# Altium schematic sheet FEM.SchDoc
size A4
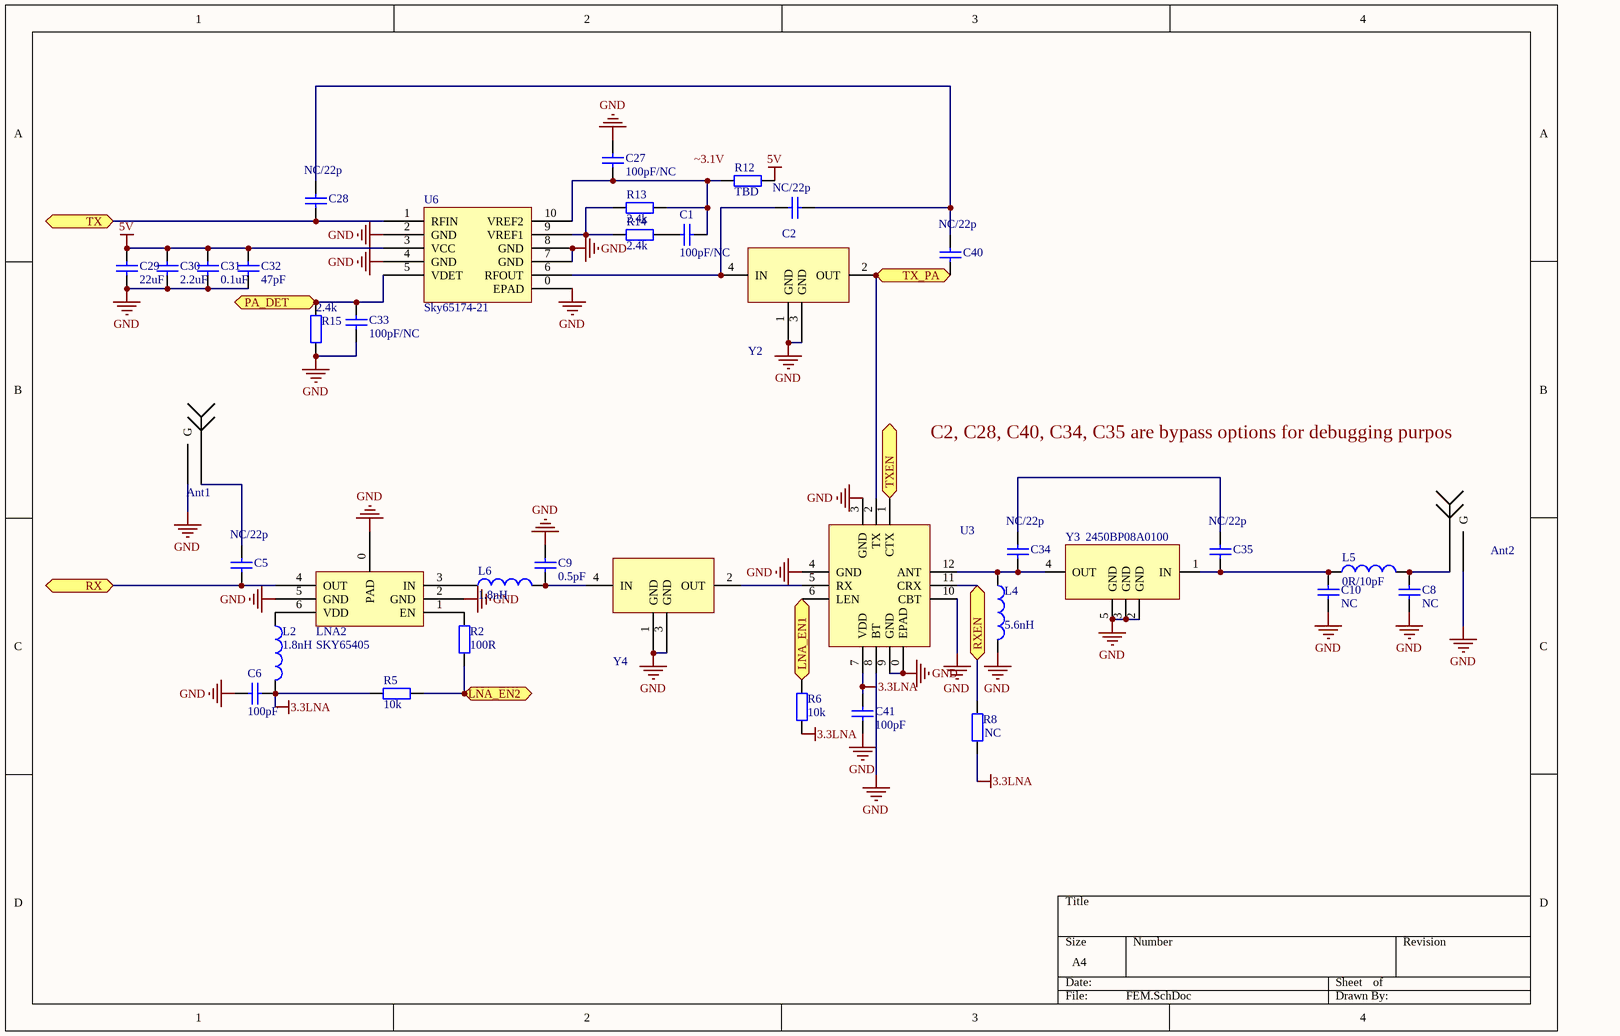
[diagram p0: FEM.SchDoc]

## Parts
Ant1  Antenna  [SMA-2]  (value not drawn)
Ant2  Antenna  [SMA-2]  (value not drawn)
C1  value 100pF/NC  [0402]  (hidden comment: Cap)
C2  NC/22p  [0402]
C5  NC/22p  [0402]
C6  value 100pF  [0402]  (hidden comment: Cap)
C8  value NC  [0402]  (hidden comment: Cap)
C9  value 0.5pF  [0402]  (hidden comment: Cap)
C10  value NC  [0402]  (hidden comment: Cap)
C27  value 100pF/NC  [0402]  (hidden comment: Cap)
C28  NC/22p  [0402]
C29  value 22uF  [0805]  (hidden comment: Cap)
C30  value 2.2uF  [0603]  (hidden comment: Cap)
C31  value 0.1uF  [0402]  (hidden comment: Cap)
C32  value 47pF  [0402]  (hidden comment: Cap)
C33  value 100pF/NC  [0402]  (hidden comment: Cap)
C34  NC/22p  [0402]
C35  NC/22p  [0402]
C40  NC/22p  [0402]
C41  value 100pF  [0402]  (hidden comment: Cap)
L2  value 1.8nH  [0402]  (hidden comment: Inductor)
L4  5.6nH  [0402]
L5  value 0R/10pF  [0402]  (hidden comment: Inductor)
L6  value 1.8nH  [0402]  (hidden comment: Inductor)
LNA2  SKY65405  [SKY65404-31]
R2  value 100R  [0402]  (hidden comment: Res2)
R5  value 10k  [0402]
R6  value 10k  [0402]
R8  NC  [0402]
R12  value TBD  [0402]  (hidden comment: Res2)
R13  value 2.4k  [0402]  (hidden comment: Res2)
R14  value 2.4k  [0402]  (hidden comment: Res2)
R15  value 2.4k  [0402]  (hidden comment: Res2)
U3  SKY85203  [SKY85203]  (value not drawn)
U6  Sky65174-21  [SKY65174-21]
Y2  2450BP39C100A  [2450BP39C100A]  (value not drawn)
Y3  2450BP08A0100  [2450BP08A0100]
Y4  2450BP39C100A  [2450BP39C100A]  (value not drawn)

## Ports
LNA_EN1, LNA_EN2, PA_DET, RX, RXEN, TX, TX_PA, TXEN

## Nets
3.3LNA: C6.2 C41.2 L2.2 R5.1 R6.1 R8.1 U3.7(VDD)
5V: C29.1 C30.1 C31.1 C32.1 R12.1 U6.3(VCC)
GND: Ant1.GND(G) Ant2.GND(G) C6.1 C8.1 C9.1 C10.1 C27.1 C29.2 C30.2 C31.2 C32.2 C33.2 C41.1 L4.2 LNA2.0(PAD) LNA2.2(GND) LNA2.5(GND) R15.1 U3.0(EPAD) U3.3(GND) U3.4(GND) U3.8(BT) U3.9(GND) U3.10(CBT) U6.0(EPAD) U6.2(GND) U6.4(GND) U6.7(GND) U6.8(GND) Y2.1(GND) Y2.3(GND) Y3.2(GND) Y3.3(GND) Y3.5(GND) Y4.1(GND) Y4.3(GND)
LNA_EN1: R6.2 U3.6(LEN) ; port LNA_EN1
LNA_EN2: R2.2 R5.2 ; port LNA_EN2
PA_DET: C33.1 R15.2 U6.5(VDET) ; port PA_DET
RX: C5.2 LNA2.4(OUT) ; port RX
RXEN: R8.2 U3.11(CRX) ; port RXEN
TX: C28.1 U6.1(RFIN) ; port TX
TX_PA: C40.2 U3.2(TX) Y2.2(OUT) ; port TX_PA
TXEN: U3.1(CTX) ; port TXEN
NetAnt1_1: Ant1.1 C5.1
NetAnt2_1: Ant2.1 C8.2 L5.2
NetC1_1: C1.1 R14.1
NetC1_2: C1.2 C27.2 R12.2 R13.1 U6.10(VREF2)
NetC2_1: C2.1 U6.6(RFOUT) Y2.4(IN)
NetC2_2: C2.2 C28.2 C40.1
NetC9_2: C9.2 L6.2 Y4.4(IN)
NetC10_2: C10.2 C35.1 L5.1 Y3.1(IN)
NetC34_1: C34.1 C35.2
NetC34_2: C34.2 L4.1 U3.12(ANT) Y3.4(OUT)
NetL2_1: L2.1 LNA2.6(VDD)
NetL6_1: L6.1 LNA2.3(IN)
NetLNA2_1: LNA2.1(EN) R2.1
NetR13_2: R13.2 R14.2 U6.9(VREF1)
NetU3_5: U3.5(RX) Y4.2(OUT)

## Notes on the sheet
- C2, C28, C40, C34, C35 are bypass options for debugging purpos
- Labels drawn without touching a wire or pin: ~3.1V

## Library data of the parts
C1 C2 C5 C6 C8-C10 C27-C35 C40 C41 = Cap: Capacitor; Published: 8-Jun-2000; LatestRevisionDate: 17-Jul-2002; LatestRevisionNote: Re-released for DXP Platform.; PackageReference: RAD-0.3; Publisher: Altium Limited; PackageDescription: Radial Cap, Thru-Hole; 2 Leads; 0.3 in Pin Spacing
L2 L4-L6 = Inductor: Code_IEC: 1005; Published: 8-Jun-2000; LatestRevisionDate: 29-May-2009; LatestRevisionNote: IPC-7351 Footprint Added.; PackageReference: 0402-A; Publisher: Altium Limited; PackageDescription: Chip Inductor; Code_JEITA: 0402
LNA2 = SKY65404-31
R2 R5 R6 R8 R12-R15 = Res2: Resistor; Published: 8-Jun-2000; LatestRevisionDate: 17-Jul-2002; LatestRevisionNote: Re-released for DXP Platform.; PackageReference: AXIAL-0.4; Publisher: Altium Limited; PackageDescription: Axial Device, Thru-Hole; 2 Leads; 0.4 in Pin Spacing